# Altium schematic sheet PDB_Connectors.SchDoc
size A; Engineer1: Fabian Hernandez; Engineer2: Jason Kim; Engineer3: Amirtha Chandrasekaran; Engineer4: Kevin Thai; Organization: My Company; Address1: Address Line 1; Address2: Address Line 2; Address3: Address Line 3; Address4: Address Line 4
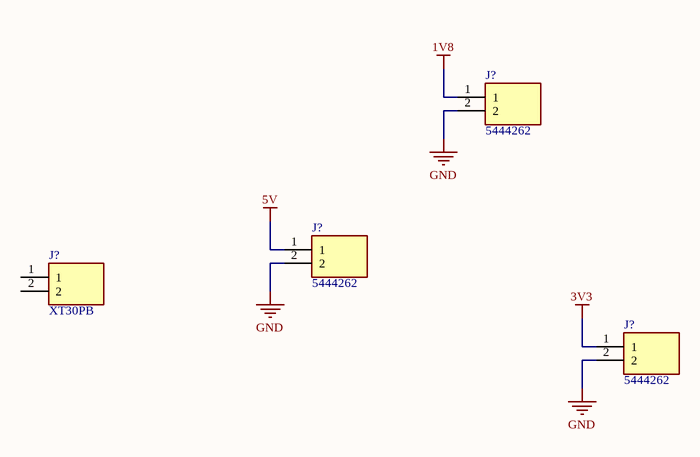
[diagram p0: PDB_Connectors.SchDoc]

## Parts
(Parts that share a designator on the sheet are numbered #1, #2 ... from top to bottom, then left to right.)
J?#1  5444262  [SHDR2W80P0X381_1X2_901X920X740P]
J?#2  5444262  [SHDR2W80P0X381_1X2_901X920X740P]
J?#3  XT30PB  [XT30PB]
J?#4  5444262  [SHDR2W80P0X381_1X2_901X920X740P]

## Nets
1V8: J?#1.1
3V3: J?#4.1
5V: J?#2.1
GND: J?#1.2 J?#2.2 J?#4.2

Not connected (* = marked no-connect by the designer): J?#3 1 2

## Notes on the sheet
- Title:
- Size:
- Engineer:
- Revision:
- Date:
- A
- Time Edited:
- Sheet
- of
- File:

## Library data of the parts
J?#1 J?#2 J?#4 = 5444262: Connector; Manufacturer_Name: Phoenix Contact; Datasheet Link: https://datasheet.datasheetarchive.com/originals/distributors/Datasheets-DGA25/1829481.pdf; Height: 7.4mm; Manufacturer_Part_Number: 5444262; Mouser Part Number: 651-5444262; Mouser Price/Stock: https://www.mouser.co.uk/ProductDetail/Phoenix-Contact/5444262?qs=9Y9qB%2FCsC3lS%2FxAVKTDcmQ%3D%3D; Arrow Part Number: 5444262; Arrow Price/Stock: https://www.arrow.com/en/products/5444262/phoenix-contact?region=nac
J?#3 = XT30PB: Connector; Manufacturer_Name: Amass; Datasheet Link: https://www.tme.eu/Document/4acc913878197f8c2e30d4b8cdc47230/XT30UPB%20SPEC.pdf; Height: 10.7mm; Manufacturer_Part_Number: XT30PB